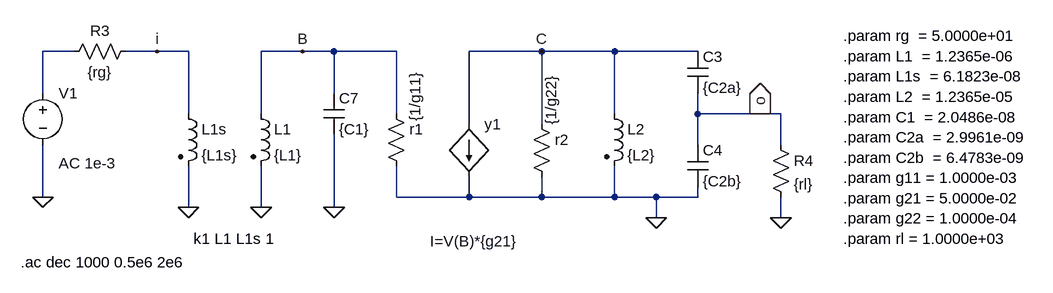
[diagram p0: schematic 20200806_RF.asc]
20200806_RF.asc, the LTspice schematic file:
Version 4
SHEET 1 940 680
WIRE -560 -48 -608 -48
WIRE -432 -48 -480 -48
WIRE -384 -48 -432 -48
WIRE -208 -48 -272 -48
WIRE -160 -48 -208 -48
WIRE -64 -48 -160 -48
WIRE 160 -48 48 -48
WIRE 272 -48 160 -48
WIRE 400 -48 272 -48
WIRE -608 16 -608 -48
WIRE -160 16 -160 -48
WIRE -384 48 -384 -48
WIRE -272 48 -272 -48
WIRE -64 48 -64 -48
WIRE 272 48 272 -48
WIRE 400 48 400 16
WIRE 496 48 400 48
WIRE 528 48 496 48
WIRE 48 64 48 -48
WIRE 160 64 160 -48
WIRE 400 96 400 48
WIRE 528 96 528 48
WIRE -608 176 -608 96
WIRE -64 176 -64 128
WIRE 48 176 48 144
WIRE 48 176 -64 176
WIRE 160 176 160 144
WIRE 160 176 48 176
WIRE 272 176 272 128
WIRE 272 176 160 176
WIRE 336 176 272 176
WIRE 400 176 400 160
WIRE 400 176 336 176
WIRE -384 192 -384 128
WIRE -272 192 -272 128
WIRE -160 192 -160 80
WIRE 336 208 336 176
WIRE 528 208 528 176
FLAG -384 192 0
FLAG -272 192 0
FLAG 336 208 0
FLAG 160 -48 C
FLAG -208 -48 B
FLAG 496 48 o
IOPIN 496 48 Out
FLAG 528 208 0
FLAG -608 176 0
FLAG -432 -48 i
FLAG -160 192 0
SYMBOL ind2 -400 32 R0
SYMATTR InstName L1s
SYMATTR Value {L1s}
SYMATTR Type ind
SYMBOL ind2 -288 32 R0
SYMATTR InstName L1
SYMATTR Value {L1}
SYMATTR Type ind
SYMBOL res -80 32 R0
WINDOW 3 45 28 VLeft 2
SYMATTR Value {1/g11}
SYMATTR InstName r1
SYMBOL res 144 48 R0
WINDOW 3 30 17 VLeft 2
SYMATTR Value {1/g22}
SYMATTR InstName r2
SYMBOL bi 48 64 R0
WINDOW 3 -60 180 Left 2
SYMATTR Value I=V(B)*{g21}
SYMATTR InstName y1
SYMBOL cap 384 -48 R0
SYMATTR InstName C3
SYMATTR Value {C2a}
SYMBOL cap 384 96 R0
SYMATTR InstName C4
SYMATTR Value {C2b}
SYMBOL res -576 -32 R270
WINDOW 0 32 56 VTop 2
WINDOW 3 0 56 VBottom 2
SYMATTR InstName R3
SYMATTR Value {rg}
SYMBOL res 512 80 R0
SYMATTR InstName R4
SYMATTR Value {rl}
SYMBOL ind2 256 32 R0
SYMATTR InstName L2
SYMATTR Value {L2}
SYMATTR Type ind
SYMBOL cap -176 16 R0
SYMATTR InstName C7
SYMATTR Value {C1}
SYMBOL voltage -608 0 R0
WINDOW 123 24 124 Left 2
WINDOW 39 0 0 Left 0
SYMATTR InstName V1
SYMATTR Value ""
SYMATTR Value2 AC 1e-3
TEXT -376 240 Left 2 !k1 L1 L1s 1
TEXT -642 276 Left 2 !.ac dec 1000 0.5e6 2e6
TEXT 624 -72 Left 2 !.param rg  = 5.0000e+01 \n.param L1  = 1.2365e-06 \n.param L1s  = 6.1823e-08 \n.param L2  = 1.2365e-05 \n.param C1  = 2.0486e-08 \n.param C2a  = 2.9961e-09 \n.param C2b  = 6.4783e-09 \n.param g11 = 1.0000e-03 \n.param g21 = 5.0000e-02 \n.param g22 = 1.0000e-04 \n.param rl = 1.0000e+03

The netlist it stands for:
* 20200806_RF.asc
L1s i 0 {L1s}
L1 B 0 {L1}
r1 B 0 {1/g11}
r2 C 0 {1/g22}
B§y1 C 0 I=V(B)*{g21}
C3 C o {C2a}
C4 o 0 {C2b}
R3 N001 i {rg}
R4 o 0 {rl}
L2 C 0 {L2}
C7 B 0 {C1}
V1 N001 0 AC 1e-3
k1 L1 L1s 1
.ac dec 1000 0.5e6 2e6
.param rg  = 5.0000e+01
.param L1  = 1.2365e-06
.param L1s  = 6.1823e-08
.param L2  = 1.2365e-05
.param C1  = 2.0486e-08
.param C2a  = 2.9961e-09
.param C2b  = 6.4783e-09
.param g11 = 1.0000e-03
.param g21 = 5.0000e-02
.param g22 = 1.0000e-04
.param rl = 1.0000e+03
.backanno
.end